# EAGLE schematic working (EAGLE 6.3)
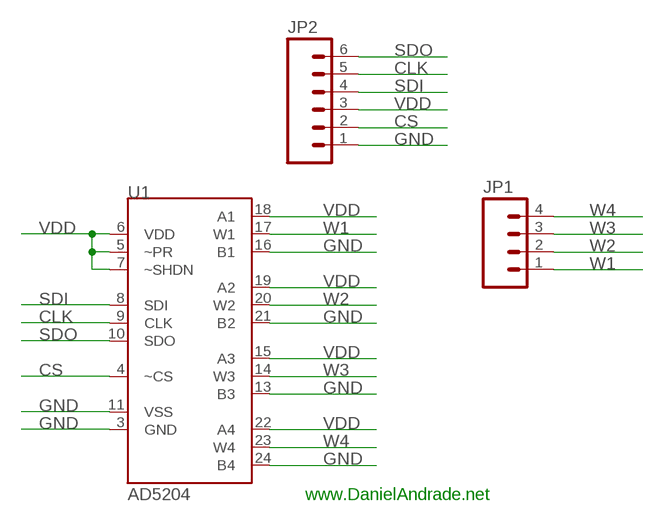
[diagram p0: schematic, sheet 1]

## Parts
JP1  M04PTH  [1X04]
JP2  M06SIP  [1X06]
U1  AD5204  [SO24W]

## Nets
CLK: JP2.5 U1.9(CLK)
CS: JP2.2 U1.4(~CS)
GND: JP2.1 U1.3(GND) U1.11(VSS) U1.13(B3) U1.16(B1) U1.21(B2) U1.24(B4)
SDI: JP2.4 U1.8(SDI)
SDO: JP2.6 U1.10(SDO)
VDD: JP2.3 U1.5(~PR) U1.6(VDD) U1.7(~SHDN) U1.15(A3) U1.18(A1) U1.19(A2) U1.22(A4)
W1: JP1.1 U1.17(W1)
W2: JP1.2 U1.20(W2)
W3: JP1.3 U1.14(W3)
W4: JP1.4 U1.23(W4)

## Notes on the sheet
- www.DanielAndrade.net

## Library data of the parts
JP1 = SparkFun-Connectors:M04: Header 4 Standard 4-pin 0.1" header. Use with straight break away headers (SKU : PRT-00116), right angle break away headers (PRT-00553), swiss pins (PRT-00743), machine pins (PRT-00117), and female headers (PRT-00115). Molex polarized connector foot print use with SKU : PRT-08231 with associated crimp pins and housings. 1MM SMD Version SKU: PRT-10208
JP2 = SparkFun-Connectors:M06: Header 6 Standard 6-pin 0.1" header. Use with straight break away headers (SKU : PRT-00116), right angle break away headers (PRT-00553), swiss pins (PRT-00743), machine pins (PRT-00117), and female headers (PRT-00115). Molex polarized connector foot print use with SKU : PRT-08094 with associated crimp pins and housings. NOTES ON THE VARIANTS LOCK and LOCK_LONGPADS... This footprint was designed to help hold the alignment of a through-hole component (i.e. 6-pin header) while soldering it into place. You may notice that each hole has been shifted either up or down by 0.005 of an inch from it's more standard position (which is a perfectly straight line). This slight alteration caused the pins (the squares in the middle) to touch the edges of the holes. Because they are alternating, it causes a "brace" to hold the component in place. 0.005 has proven to be the perfect amount of "off-center" position when using our standard breakaway headers. Although looks a little odd when you look at the bare footprint, once you have a header in there, the alteration is very hard to notice. Also,if you push a header all the way into place, it is covered up entirely on the bottom side. This idea of altering the position of holes to aid alignment will be further integrated into the Sparkfun Library for other footprints. It can help hold any component with 3 or more connection pins.
U1 = moje:AD5204

## Net classes
0 default: width 0.3 mm, drill 0.6 mm, clearance 0.3 mm
1 supply: width 0.3 mm, drill 0.6 mm, clearance 0.3 mm to class 0, clearance 0.3 mm
2 POWER: width 0.3 mm, drill 0.6 mm, clearance 0.4 mm to class 0, clearance 0.4 mm to class 1, clearance 0.5 mm